# Altium schematic sheet SH1 - POWER.SchDoc: POWER
size 431 x 279 mm; Engineer: Taylor McNabb; Revision: 2; SheetNumber: 1; SheetTotal: 3
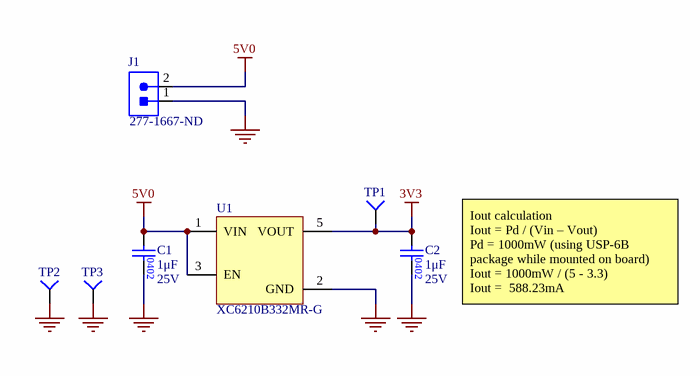
[diagram p0: SH1 - POWER.SchDoc]

## Parts
C1  value 1μF  Voltage: 25V  [CAP0402]  (hidden comment: CAP_1uF_25V_0402)
C2  value 1μF  Voltage: 25V  [CAP0402]  (hidden comment: CAP_1uF_25V_0402)
J1  Supplier Part Number 1: 277-1667-ND  [1935161]  (hidden comment: CON_2POS_SCREW_TERM)
TP1  TESTPOINT_SMD_LOOP  [S1751-46R]  (value not drawn)
TP2  TESTPOINT_SMD_LOOP  [S1751-46R]  (value not drawn)
TP3  TESTPOINT_SMD_LOOP  [S1751-46R]  (value not drawn)
U1  Manufacturer Part Number 1: XC6210B332MR-G  [SOT95P285X140-5N]  (hidden comment: LDO_3.3V_700mA)

## Nets
3V3: C2.1 TP1.1(=value) U1.5(VOUT)
5V0: C1.1 J1.2 U1.1(VIN) U1.3(EN)
GND: C1.2 C2.2 J1.1 TP2.1(=value) TP3.1(=value) U1.2(GND)

## Notes on the sheet
- (near C2) Iout calculation
  Iout = Pd / (Vin – Vout)
  Pd = 1000mW (using USP-6B package while mounted on board)
  Iout = 1000mW / (5 - 3.3)
  Iout =  588.23mA
- University of Waterloo Robotics Team
- 200 University Ave W
- REV
- PROJECT
- Waterloo, Ontario, Canada
- N2L 3G1
- DOCUMENT
- ENGINEER
- REVIEWER
- MODIFIED
- SHEET
- OF

## Library data of the parts
C1 C2 = CAP_1uF_25V_0402: CAP CER 1UF 25V X5R 0402; Manufacturer 1: TDK Corporation; Manufacturer Part Number 1: C1005X5R1E105K050BE; Supplier 1: Digi-Key; Supplier Part Number 1: 445-175215-1-ND; Package: 0402
J1 = CON_2POS_SCREW_TERM: TERM BLK 2POS SIDE ENTRY 5MM; Manufacturer 1: Phoenix Contact; Package/Footprint: SMD; Supplier 1: Digi-Key; Mounting Type: TH; Manufacturer Part Number 1: 1935161
TP1-TP3 = TESTPOINT_SMD_LOOP: PC TEST POINT SMD; Manufacturer 1: Harwin; Supplier 1: Digi-Key; Manufacturer Part Number 1: S1751-46R; Supplier Part Number 1: 952-1478-1-ND; Mounting Type: SMD; Package/Footprint: SMD
U1 = LDO_3.3V_700mA: IC REG LINEAR 3.3V 700MA SOT25; Manufacturer 1: Diodes Incorporated; Input Voltage (Max): 6V; Voltage Dropout (Max): 0.075V; Package/Footprint: SOT-25; Output Voltage (Fixed): 3.3V; Output Current: 700mA; Operating Temperature: -40°C - 85°C; Mounting Type: SMD; Supplier 1: Digi-Key; Supplier Part Number 1: 893-1075-1-ND